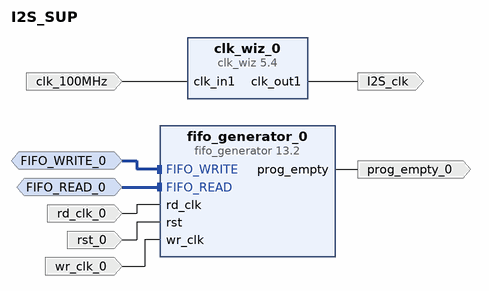
[diagram p0: block diagram of the top level]
# Vivado block design I2S_SUP, xc7a35tftg256-1, Vivado 2017.4
create_bd_design I2S_SUP

create_bd_intf_port -mode Slave -vlnv xilinx.com:interface:fifo_write_rtl:1.0 FIFO_WRITE_0
create_bd_intf_port -mode Slave -vlnv xilinx.com:interface:fifo_read_rtl:1.0 FIFO_READ_0
create_bd_port -dir O prog_empty_0
create_bd_port -dir I -type clk rd_clk_0
create_bd_port -dir I rst_0
create_bd_port -dir I -type clk wr_clk_0
create_bd_port -dir I -type clk clk_100MHz
set_property -dict {CONFIG.FREQ_HZ 100000000} [get_bd_ports clk_100MHz]
create_bd_port -dir O -type clk I2S_clk
set_property -dict {CONFIG.FREQ_HZ 16934404} [get_bd_ports I2S_clk]

create_bd_cell -type ip -vlnv xilinx.com:ip:fifo_generator:13.2 fifo_generator_0
set_property -dict [list \
  CONFIG.Fifo_Implementation Independent_Clocks_Block_RAM \
  CONFIG.synchronization_stages 2 \
  CONFIG.INTERFACE_TYPE Native \
  CONFIG.Input_Data_Width 32 \
  CONFIG.Input_Depth 32768 \
  CONFIG.Output_Data_Width 16 \
  CONFIG.Full_Flags_Reset_Value 1 \
  CONFIG.Programmable_Full_Type No_Programmable_Full_Threshold \
  CONFIG.Programmable_Empty_Type Multiple_Programmable_Empty_Threshold_Constants \
  CONFIG.Empty_Threshold_Assert_Value 5000 \
  CONFIG.Empty_Threshold_Negate_Value 27000 \
  CONFIG.FIFO_Implementation_wach Common_Clock_Distributed_RAM \
  CONFIG.FIFO_Implementation_wrch Common_Clock_Distributed_RAM \
  CONFIG.FIFO_Implementation_rach Common_Clock_Distributed_RAM \
  CONFIG.Enable_Safety_Circuit true \
] [get_bd_cells fifo_generator_0]
create_bd_cell -type ip -vlnv xilinx.com:ip:clk_wiz:5.4 clk_wiz_0
set_property -dict [list \
  CONFIG.CLKOUT1_REQUESTED_OUT_FREQ 16.9344 \
  CONFIG.USE_LOCKED false \
  CONFIG.USE_RESET false \
  CONFIG.MMCM_DIVCLK_DIVIDE 3 \
  CONFIG.MMCM_CLKFBOUT_MULT_F 31.625 \
  CONFIG.MMCM_CLKOUT0_DIVIDE_F 62.250 \
  CONFIG.CLKOUT1_JITTER 272.870 \
  CONFIG.CLKOUT1_PHASE_ERROR 189.550 \
] [get_bd_cells clk_wiz_0]

# ---- connections ----

connect_bd_intf_net -intf_net FIFO_WRITE_0_1 [get_bd_intf_ports FIFO_WRITE_0] [get_bd_intf_pins fifo_generator_0/FIFO_WRITE]
connect_bd_intf_net -intf_net FIFO_READ_0_1 [get_bd_intf_ports FIFO_READ_0] [get_bd_intf_pins fifo_generator_0/FIFO_READ]
connect_bd_net [get_bd_pins fifo_generator_0/prog_empty] [get_bd_ports prog_empty_0]
connect_bd_net -net rd_clk_0_1 [get_bd_ports rd_clk_0] [get_bd_pins fifo_generator_0/rd_clk]
connect_bd_net -net rst_0_1 [get_bd_ports rst_0] [get_bd_pins fifo_generator_0/rst]
connect_bd_net -net wr_clk_0_1 [get_bd_ports wr_clk_0] [get_bd_pins fifo_generator_0/wr_clk]
connect_bd_net [get_bd_ports clk_100MHz] [get_bd_pins clk_wiz_0/clk_in1]
connect_bd_net [get_bd_pins clk_wiz_0/clk_out1] [get_bd_ports I2S_clk]

validate_bd_design
save_bd_design
